# EAGLE design SenseBox-Shield_v10 (EAGLE 7.5.0)
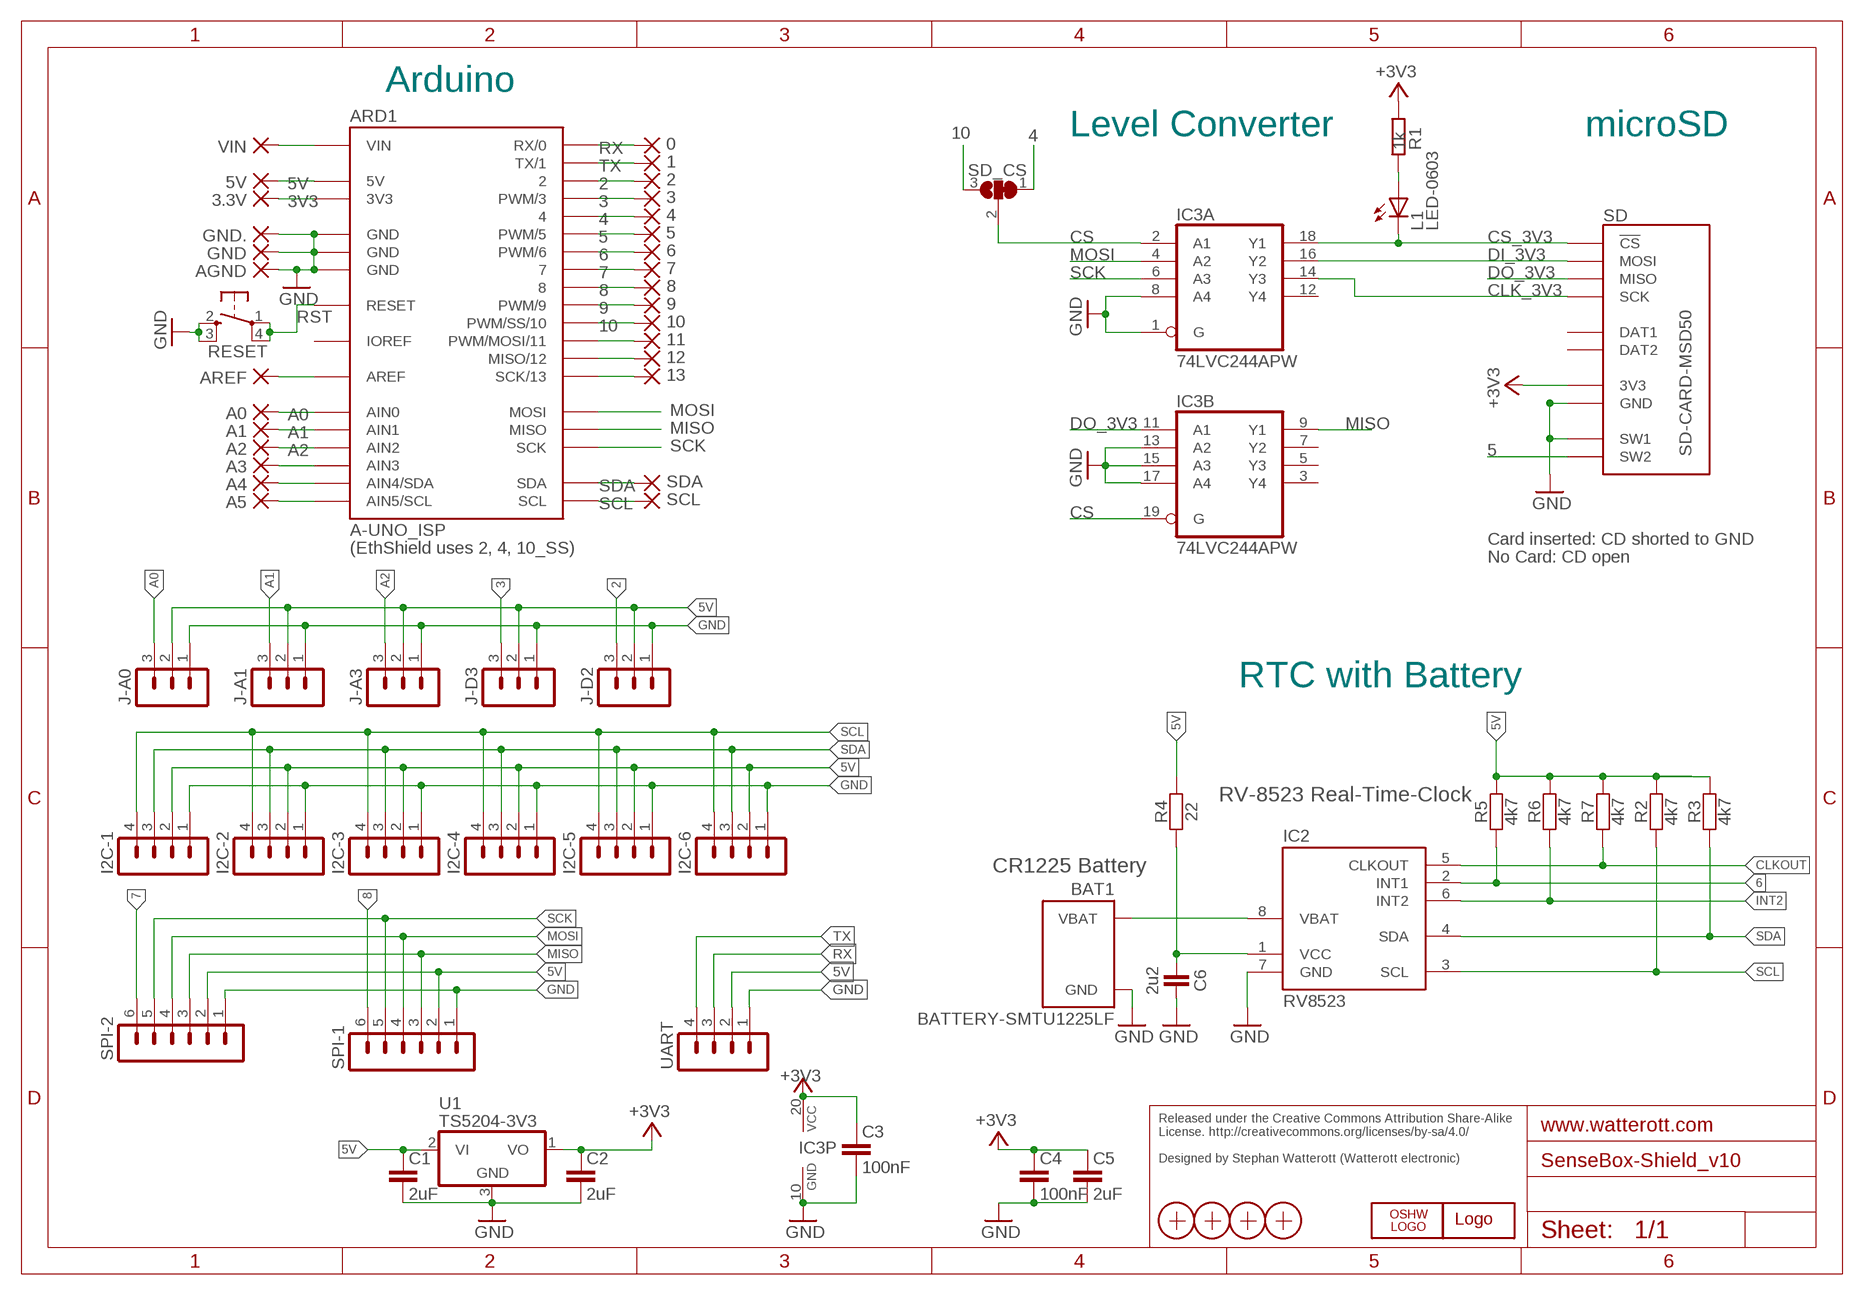
[diagram p0: schematic, sheet 1]

## Parts
0  1,6/0,8  [1,6/0,8]
1  1,6/0,8  [1,6/0,8]
2  1,6/0,8  [1,6/0,8]
3  1,6/0,8  [1,6/0,8]
3.3V  1,6/0,8  [1,6/0,8]
4  1,6/0,8  [1,6/0,8]
5  1,6/0,8  [1,6/0,8]
5V  1,6/0,8  [1,6/0,8]
6  1,6/0,8  [1,6/0,8]
7  1,6/0,8  [1,6/0,8]
8  1,6/0,8  [1,6/0,8]
9  1,6/0,8  [1,6/0,8]
10  1,6/0,8  [1,6/0,8]
11  1,6/0,8  [1,6/0,8]
12  1,6/0,8  [1,6/0,8]
13  1,6/0,8  [1,6/0,8]
A0  1,6/0,8  [1,6/0,8]
A1  1,6/0,8  [1,6/0,8]
A2  1,6/0,8  [1,6/0,8]
A3  1,6/0,8  [1,6/0,8]
A4  1,6/0,8  [1,6/0,8]
A5  1,6/0,8  [1,6/0,8]
AGND  1,6/0,8  [1,6/0,8]
ARD1  A-UNO_ISP  [A-UNO-ISP]
AREF  1,6/0,8  [1,6/0,8]
BAT1  BATTERY-SMTU1225LF  [BAT-SMTU1225LF]
C1  2uF  C-EUC0805  [C0805]
C2  2uF  C-EUC0805  [C0805]
C3  100nF  C-EUC0603  [C0603]
C4  100nF  C-EUC0603  [C0603]
C5  2uF  C-EUC0603  [C0603]
C6  2u2  CAPACITOR-C0603  [R0603]
GND  1,6/0,8  [1,6/0,8]
GND.  1,6/0,8  [1,6/0,8]
I2C-1  JST_PH_4B4B-PH-SM4-TB  [JST_B4B-PH-SM4-TB]
I2C-2  JST_PH_4B4B-PH-SM4-TB  [JST_B4B-PH-SM4-TB]
I2C-3  JST_PH_4B4B-PH-SM4-TB  [JST_B4B-PH-SM4-TB]
I2C-4  JST_PH_4B4B-PH-SM4-TB  [JST_B4B-PH-SM4-TB]
I2C-5  JST_PH_4B4B-PH-SM4-TB  [JST_B4B-PH-SM4-TB]
I2C-6  JST_PH_4B4B-PH-SM4-TB  [JST_B4B-PH-SM4-TB]
IC2  RV8523  RV8523-C3  [RTC-C3]
IC3  74LVC244APW  74LVC244PW  [TSSOP20]
J-A0  JST_PH_3B3B-PH-SM4-TB  [JST_B3B-PH-SM4-TB]
J-A1  JST_PH_3B3B-PH-SM4-TB  [JST_B3B-PH-SM4-TB]
J-A3  JST_PH_3B3B-PH-SM4-TB  [JST_B3B-PH-SM4-TB]
J-D2  JST_PH_3B3B-PH-SM4-TB  [JST_B3B-PH-SM4-TB]
J-D3  JST_PH_3B3B-PH-SM4-TB  [JST_B3B-PH-SM4-TB]
L1  LED-0603  [LED_0603]
LOGO2  WE-LOGOPLACE  [WE-LOGO]
LOGO3  OSHW_LOGO_6MILX0100-NT  [OSHW_6X100_NOTEXT]
R1  1k  R-EU_R0603  [R0603]
R2  4k7  RESISTOR-R0603  [R0603]
R3  4k7  RESISTOR-R0603  [R0603]
R4  22  RESISTOR-R0603  [R0603]
R5  4k7  RESISTOR-R0603  [R0603]
R6  4k7  RESISTOR-R0603  [R0603]
R7  4k7  RESISTOR-R0603  [R0603]
RESET  SW4S  [SW_SMD4]
SCL  1,6/0,8  [1,6/0,8]
SD  SD-CARD-MSD50  [SD_5031821853]
SD_CS  SJ2W  [SJ_2]
SDA  1,6/0,8  [1,6/0,8]
SPI-1  JST_PH_6B6B-PH-SM4-TB  [JST_B6B-PH-SM4-TB]
SPI-2  JST_PH_6B6B-PH-SM4-TB  [JST_B6B-PH-SM4-TB]
U1  TS5204-3V3  TS5204  [SOT23]
UART  JST_PH_4B4B-PH-SM4-TB  [JST_B4B-PH-SM4-TB]
VIN  1,6/0,8  [1,6/0,8]
X1  PASSER  [PASSER]
X2  PASSER  [PASSER]
X3  PASSER  [PASSER]
X4  PASSER  [PASSER]

## Nets
2: 2.1(P) ARD1.2 J-D2.3
3: 3.1(P) ARD1.3(PWM/3) J-D3.3
3V3: 3.3V.1(P) ARD1.3V3
4: 4.1(P) ARD1.4 SD_CS.1
5: 5.1(P) ARD1.5(PWM/5) SD.SW2
5V: 5V.1(P) ARD1.5V C1.1 I2C-1.2 I2C-2.2 I2C-3.2 I2C-4.2 I2C-5.2 I2C-6.2 J-A0.2 J-A1.2 J-A3.2 J-D2.2 J-D3.2 R2.2 R3.2 R4.2 R5.2 R6.2 R7.2 SPI-1.2 SPI-2.2 U1.2(VI) UART.2
6: 6.1(P) ARD1.6(PWM/6) IC2.2(INT1) R5.1
7: 7.1(P) ARD1.7 SPI-2.6
8: 8.1(P) ARD1.8 SPI-1.6
9: 9.1(P) ARD1.9(PWM/9)
10: 10.1(P) ARD1.10(PWM/SS/10) SD_CS.3
11: 11.1(P) ARD1.11(PWM/MOSI/11)
12: 12.1(P) ARD1.12(MISO/12)
13: 13.1(P) ARD1.13(SCK/13)
+3V3: C2.1 C3.1 C4.1 C5.1 IC3.20(P:VCC) R1.1 SD.VCC(3V3) U1.1(VO)
A0: A0.1(P) ARD1.A0(AIN0) J-A0.3
A1: A1.1(P) ARD1.A1(AIN1) J-A1.3
A2: A2.1(P) ARD1.A2(AIN2) J-A3.3
AIN3: A3.1(P) ARD1.A3(AIN3)
AIN4: A4.1(P) ARD1.A4(AIN4/SDA)
AIN5: A5.1(P) ARD1.A5(AIN5/SCL)
AREF: ARD1.AREF AREF.1(P)
CLK_3V3: IC3.14(A:Y3) SD.SCK
CLKOUT: IC2.5(CLKOUT) R7.1
CS: IC3.2(A:A1) IC3.19(B:G) SD_CS.2
CS_3V3: IC3.18(A:Y1) L1.C SD.CS(!CS)
DI_3V3: IC3.16(A:Y2) SD.MOSI
DO_3V3: IC3.11(B:A1) SD.MISO
GND: AGND.1(P) ARD1.GND@1(GND) ARD1.GND@2(GND) ARD1.GND@3(GND) BAT1.-(GND) C1.2 C2.2 C3.2 C4.2 C5.2 C6.2 GND.1(P) GND..1(P) I2C-1.1 I2C-2.1 I2C-3.1 I2C-4.1 I2C-5.1 I2C-6.1 IC2.7(GND) IC3.1(A:G) IC3.8(A:A4) IC3.10(P:GND) IC3.13(B:A2) IC3.15(B:A3) IC3.17(B:A4) J-A0.1 J-A1.1 J-A3.1 J-D2.1 J-D3.1 RESET.2(S) RESET.3(S1) SD.GND SD.SW1 SPI-1.1 SPI-2.1 U1.3(GND) UART.1
INT2: IC2.6(INT2) R6.1
MISO: ARD1.MISO IC3.9(B:Y1) SPI-1.3 SPI-2.3
MOSI: ARD1.MOSI IC3.4(A:A2) SPI-1.4 SPI-2.4
N$12: L1.A R1.2
RST: ARD1.RST(RESET) RESET.1(P) RESET.4(P1)
RV_VCC: C6.1 IC2.1(VCC) R4.1
RX: 0.1(P) ARD1.0(RX/0) UART.3
SCK: ARD1.SCK IC3.6(A:A3) SPI-1.5 SPI-2.5
SCL: ARD1.SCL I2C-1.4 I2C-2.4 I2C-3.4 I2C-4.4 I2C-5.4 I2C-6.4 IC2.3(SCL) R2.1 SCL.1(P)
SDA: ARD1.SDA I2C-1.3 I2C-2.3 I2C-3.3 I2C-4.3 I2C-5.3 I2C-6.3 IC2.4(SDA) R3.1 SDA.1(P)
TX: 1.1(P) ARD1.1(TX/1) UART.4
VBAT: BAT1.+(VBAT) IC2.8(VBAT)
VIN: ARD1.VIN VIN.1(P)
Unconnected: IC3.3(B:Y4) IC3.5(B:Y3) IC3.7(B:Y2) IC3.12(A:Y4) SD.DAT1 SD.DAT2

## Notes on the sheet
- Arduino
- Level Converter | microSD
- Card inserted: CD shorted to GND
- (EthShield uses 2, 4, 10_SS)
- No Card: CD open
- RTC with Battery
- RV-8523 Real-Time-Clock
- CR1225 Battery
- Released under the Creative Commons Attribution Share-Alike 
  License. http://creativecommons.org/licenses/by-sa/4.0/
  
  Designed by Stephan Watterott (Watterott electronic)

## Power pins joined to a net without a drawn wire
IOREF: ARD1.IOREF

## Library data of the parts
0 1-3 3.3V 4 5 5V 6-13 A0 A1-A5 AGND AREF GND GND. SCL SDA VIN = wirepad:1,6/0,8: THROUGH-HOLE PAD
ARD1 = we-board:A-UNO_ISP: Arduino Uno
BAT1 = we-power:BATTERY: Battery Holder
C1-C5 = rcl:C-EU: CAPACITOR, European symbol
C6 = we-rcl:CAPACITOR: Capacitors ...2.2uF -> 0603 ...4.7uF -> 0805 ...10uF -> 1206
I2C-1-I2C-6 UART = we-con:JST_PH_4
IC2 = we-chip:RV8523: Micro Crystal RV-8323 RTC (Real Time Clock)
IC3 = we-chip:74*244: 74x244 Octal Buffer and Line Driver (3-State)
J-A0 J-A1 J-A3 J-D2 J-D3 = we-con:JST_PH_3: JST Connector
L1 = we-opto:LED
LOGO2 = welectronic:WE-LOGO
LOGO3 = OSHW:OSHW_LOGO_6MIL
R1 = rcl:R-EU_: RESISTOR, European symbol
R2-R7 = we-rcl:RESISTOR: Resistors all kinds in 0603
RESET = Switch-SMD:SW4
SD = we-con:SD-CARD; DIGIKEY: WM9750TR-ND
SD_CS = jumper:SJ2W: SMD solder JUMPER
SPI-1 SPI-2 = we-con:JST_PH_6
U1 = Voltage-Reg:TS5204
X1-X4 = SMD:PASSER

## Board
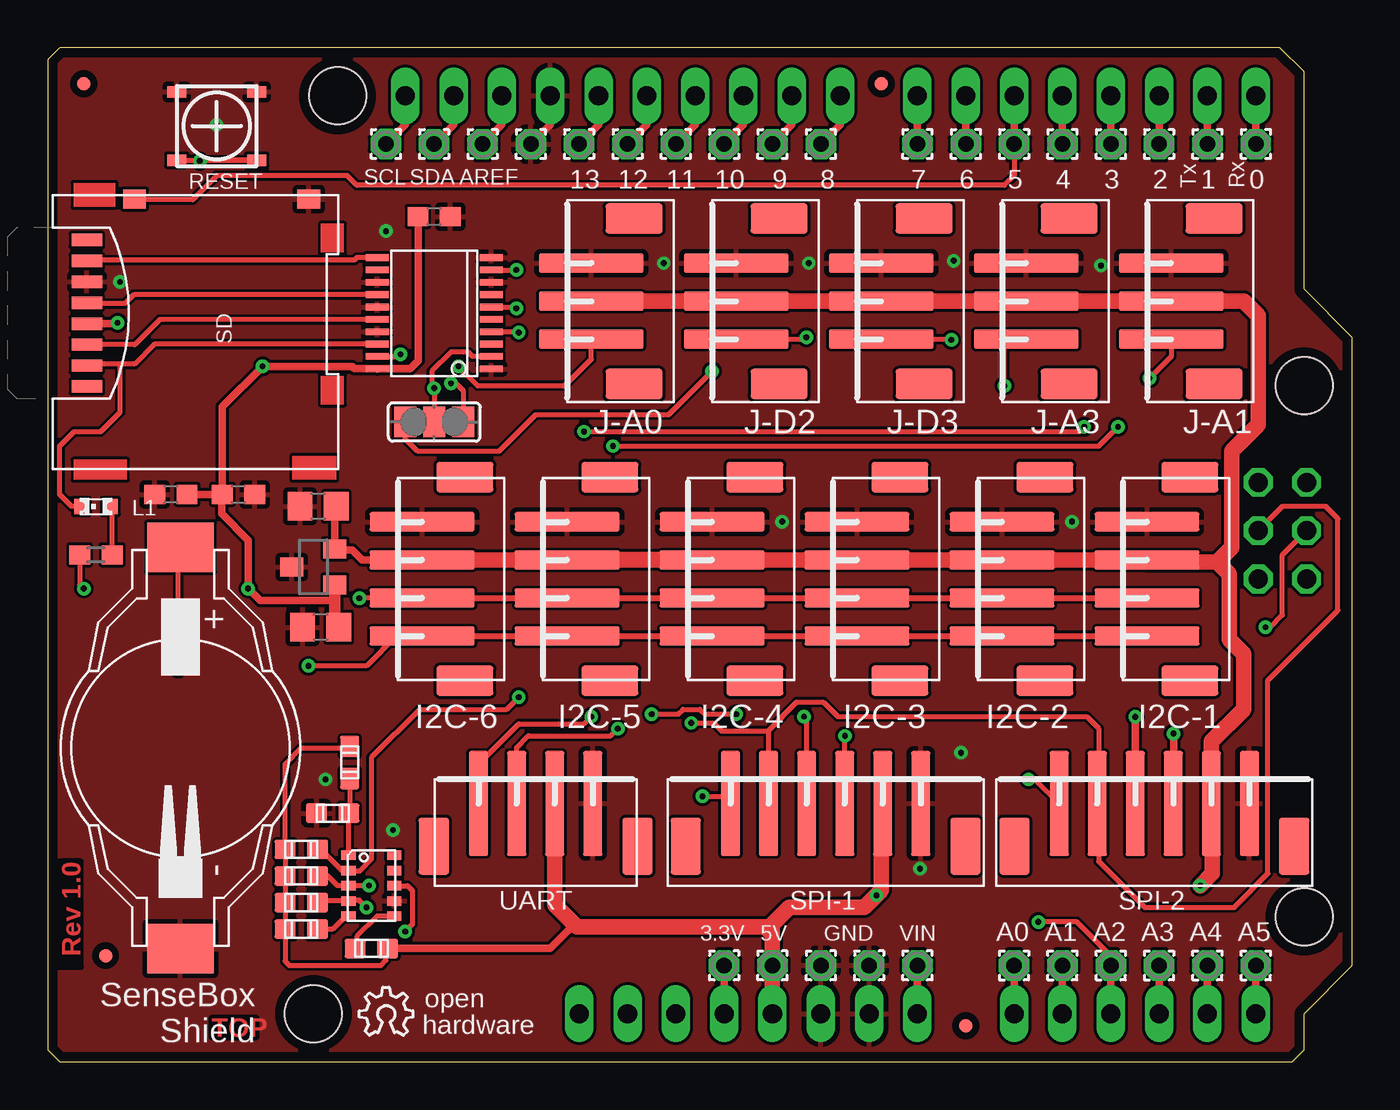
[diagram p1: board, top side]
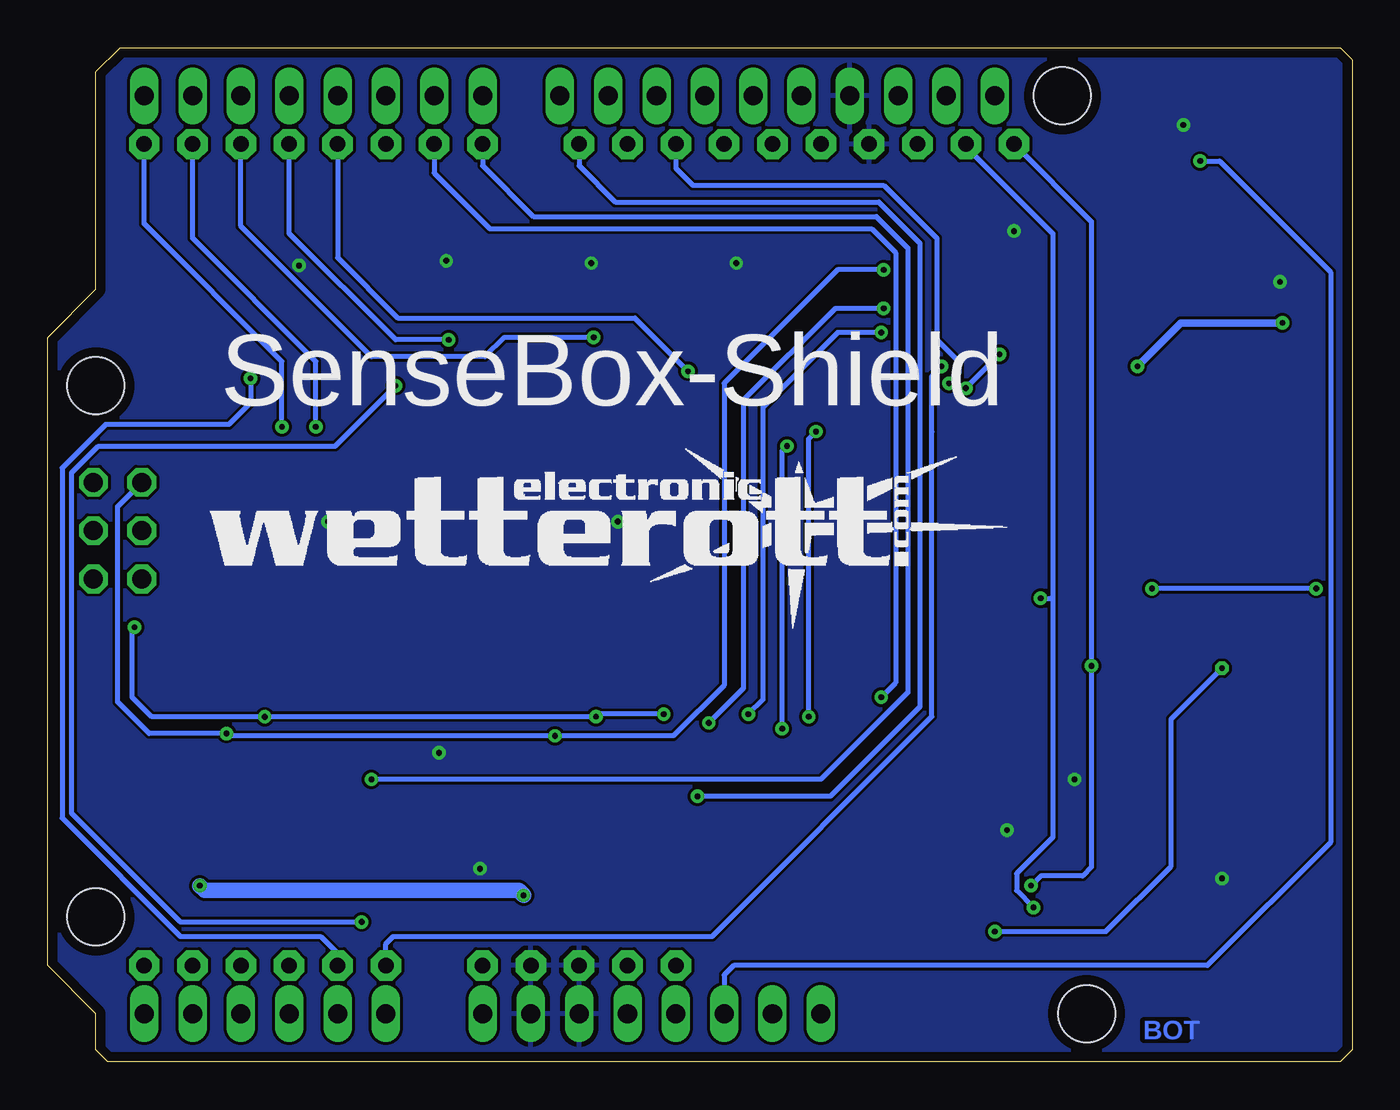
[diagram p2: board, bottom side, seen from below]

Size 68.58 x 53.34 mm. Coordinates in mm from the lower left corner, seen from the top.
Copper layers (1*16): Top 0.035mm / dielectric 1.5mm / Bottom 0.035mm
Design rules "default *": minimum track width 6mil, minimum drill 0.29mm, track to track 6mil, track to pad 6mil, pad to pad 6mil, via to via 6mil, smd to smd 0mil, copper to edge 20mil, drill to drill 8mil, minimum pad ring 10mil, minimum via ring 8mil, stop-mask expansion 4mil, vias tented up to drill 0.5mm, thermal gap 10mil

### Footprints (pad centres in the part's own frame; a part is rotated, then mirrored left to right if it is on the bottom)
1,6/0,8 = drill 0.813 pad 1.6 octagon: 1 0,0
A-UNO-ISP = drill 1 long: 0 63.5,50.8; 1 60.96,50.8; 2 58.42,50.8; 3 55.88,50.8; 3V3 35.56,2.54; 4 53.34,50.8; 5 50.8,50.8; 5V 38.1,2.54; 6 48.26,50.8; 7 45.72,50.8; 8 41.656,50.8; 9 39.116,50.8; 10 36.576,50.8; 11 34.036,50.8; 12 31.496,50.8; 13 28.956,50.8; A0 50.8,2.54; A1 53.34,2.54; A2 55.88,2.54; A3 58.42,2.54; A4 60.96,2.54; A5 63.5,2.54; AREF 23.876,50.8; GND@1 40.64,2.54; GND@2 43.18,2.54; GND@3 26.416,50.8; IOREF 30.48,2.54; NC 27.94,2.54; RST 33.02,2.54; SCL 18.796,50.8; SDA 21.336,50.8; VIN 45.72,2.54 | drill 1 octagon: GND@4 66.167,25.4; MISO 63.627,30.48; MOSI 66.167,27.94; RST2 63.627,25.4; SCK 63.627,27.94; VCC 66.167,30.48 | hole 3: 66.04,35.56; 66.04,7.62; 15.24,50.8; 13.97,2.54
BAT-SMTU1225LF = smd 3.5 x 2.6: + 0,10.55; - 0,-10.55
C0805 = smd 1.3 x 1.5: 1 -0.95,0; 2 0.95,0
C0603 = smd 1.1 x 1: 1 -0.85,0; 2 0.85,0
R0603 = smd 1 x 1.1: 1 0,0.85; 2 0,-0.85
JST_B4B-PH-SM4-TB = smd 5.5 x 1: 1 0,3; 2 0,1; 3 0,-1; 4 0,-3 | smd 3 x 1.6: SHLD1 2.25,5.35; SHLD2 2.25,-5.35
RTC-C3 = smd 0.8 x 0.5: 1 -1.2,1.6; 2 -1.2,0.8; 3 -1.2,0; 4 -1.2,-0.8; 5 -1.2,-1.6; 6 1.2,-1.6; 7 1.2,-0.8; 8 1.2,0; 9 1.2,0.8; 10 1.2,1.6
TSSOP20 = smd 0.35 x 1.2: 1 -2.925,-3; 2 -2.275,-3; 3 -1.625,-3; 4 -0.975,-3; 5 -0.325,-3; 6 0.325,-3; 7 0.975,-3; 8 1.625,-3; 9 2.275,-3; 10 2.925,-3; 11 2.925,3; 12 2.275,3; 13 1.625,3; 14 0.975,3; 15 0.325,3; 16 -0.325,3; 17 -0.975,3; 18 -1.625,3; 19 -2.275,3; 20 -2.925,3
JST_B3B-PH-SM4-TB = smd 5.5 x 1: 1 0,2; 2 0,0; 3 0,-2 | smd 3 x 1.6: SHLD1 2.25,4.35; SHLD2 2.25,-4.35
LED_0603 = smd 0.8 x 0.8: A 0,-0.75; C 0,0.75
R0603' = smd 1.1 x 1: 1 -0.85,0; 2 0.85,0
SW_SMD4 = smd 0.61 x 1.016: 1 -1.8,-2.1; 2 1.8,-2.1; 3 1.8,2.1; 4 -1.8,2.1
SD_5031821853 = smd 0.65 x 1.6: CS 2.75,0.8; DAT1 -3.85,0.8; DAT2 3.85,0.8; GND -1.65,0.8; MISO -2.75,0.8; MOSI 1.65,0.8; SCK -0.55,0.8; VCC 0.55,0.8 | smd 1 x 1.2: SW1 -6,12.45; SW2 -6,3.3
SJ_2 = smd 1.168 x 1.6: 1 -1.524,0; 2 0,0; 3 1.524,0
JST_B6B-PH-SM4-TB = smd 5.5 x 1: 1 0,5; 2 0,3; 3 0,1; 4 0,-1; 5 0,-3; 6 0,-5 | smd 3 x 1.6: SHLD1 2.25,7.35; SHLD2 2.25,-7.35
SOT23 = smd 1 x 1.2: 1 -0.95,-1.132; 2 0.95,-1.132; 3 0,1.132
PASSER = smd 0.7 x 0.7: X 0,0

### Placement (x,y rotation side)
0  63.5,48.26 0 top
1  60.96,48.26 0 top
2  58.42,48.26 0 top
3  55.88,48.26 0 top
3.3V  35.56,5.08 0 top
4  53.34,48.26 0 top
5  50.8,48.26 0 top
5V  38.1,5.08 0 top
6  48.26,48.26 0 top
7  45.72,48.26 0 top
8  40.64,48.26 0 top
9  38.1,48.26 0 top
10  35.56,48.26 0 top
11  33.02,48.26 0 top
12  30.48,48.26 0 top
13  27.94,48.26 0 top
A0  50.8,5.08 180 top
A1  53.34,5.08 180 top
A2  55.88,5.08 180 top
A3  58.42,5.08 180 top
A4  60.96,5.08 180 top
A5  63.5,5.08 180 top
AGND  25.4,48.26 0 top
ARD1  0,0 0 top
AREF  22.86,48.26 0 top
BAT1  6.99,16.51 0 top
C1  14.22,29.21 180 top
C2  14.35,22.86 180 top
C3  6.48,29.84 180 top
C4  20.32,44.45 0 top
C5  10.03,29.84 0 top
C6  14.99,13.08 270 top
GND  43.18,5.08 0 top
GND.  40.64,5.08 0 top
I2C-1  57.78,25.4 0 top
I2C-2  50.16,25.4 0 top
I2C-3  42.55,25.4 0 top
I2C-4  34.92,25.4 0 top
I2C-5  27.3,25.4 0 top
I2C-6  19.68,25.4 0 top
IC2  17.02,9.27 0 top
IC3  20.32,39.37 90 top
J-A0  28.57,40.01 0 top
J-A1  59.05,40.01 0 top
J-A3  51.44,40.01 0 top
J-D2  36.2,40.01 0 top
J-D3  43.81,40.01 0 top
L1  2.54,29.21 90 top
LOGO2  60.33,22.48 0 bottom
LOGO3  16.38,1.4 0 top
R1  1k  [R0603']  2.54,26.67 0 top
R2  13.34,9.78 270 top
R3  13.34,8.38 270 top
R4  15.88,15.75 180 top
R5  13.34,11.18 270 top
R6  17.02,5.97 90 top
R7  13.34,6.99 270 top
RESET  8.89,49.21 90 top
SCL  17.78,48.26 0 top
SD  1.27,39.37 270 top
SD_CS  20.32,33.66 0 top
SDA  20.32,48.26 0 top
SPI-1  40.89,13.59 270 top
SPI-2  58.17,13.59 270 top
U1  13.97,26.04 90 top
UART  25.65,13.59 270 top
VIN  45.72,5.08 0 top
X1  3.05,5.59 0 top
X2  1.91,51.44 0 top
X3  43.81,51.44 0 top
X4  48.26,1.91 0 top

### Tracks (layer width: path | path; a pad name or v marks a point on that pad's centre or on a via)
2  (via drill 0.3)
  Top 0.254: J-D2.3 39.78,38.01 v39.88,38.1
  Top 0.406: ARD1.2 2.1
  Bottom 0.254: v39.88,38.1 44.58,38.1 45.59,37.08 51.56,37.08 58.42,43.94 2.1
3  (via drill 0.3)
  Top 0.254: J-D3.3 47.47,38.01 v47.5,37.97
  Top 0.406: ARD1.3 3.1
  Bottom 0.254: v47.5,37.97 50.29,37.97 55.88,43.56 3.1
3V3
  Top 0.406: ARD1.3V3 3.3V.1
4  (via drill 0.3)
  Top 0.254: SD_CS.1 18.8,32.77 19.43,32.13 23.75,32.13 25.65,34.04 32.64,34.04 v34.92,36.32
  Top 0.406: ARD1.4 4.1
  Bottom 0.254: 4.1 53.34,42.29 50.16,39.12 37.72,39.12 v34.92,36.32
5
  Top 0.254: 5.1 50.8,46.61 50.29,46.1 16.26,46.1 15.75,46.61 8.89,46.61 7.62,45.34 4.6,45.34 SD.SW2
  Top 0.406: ARD1.5 5.1
5V  (via drill 0.3)
  Top 0.254: R4.2 15.79,16.51 13.34,16.51 12.48,15.66 R5.2 R2.2 R3.2 R7.2 12.48,5.29 12.7,5.08 17.53,5.08 17.78,5.33 17.78,5.88 R6.2
  Top 0.406: C1.1 15.1,29.03 U1.2 15.16,26.92 16,26.92 16.53,26.4 I2C-6.2 | R6.2 26.42,5.97 27.69,7.24
  Top 0.813: I2C-2.2 I2C-1.2 57.9,26.29 61.47,26.29 | I2C-4.2 I2C-3.2 I2C-2.2 | 26.67,26.42 26.69,26.4 I2C-5.2 I2C-4.2 | 26.67,26.42 34.91,26.42 I2C-4.2 | I2C-2.2 57.67,26.4 | 57.67,26.4 57.78,26.29 | 57.67,26.4 57.66,26.42 57.91,26.42 | 61.47,26.29 62.1,25.65 62.1,22.23 62.87,21.46 62.87,18.54 61.17,16.84 SPI-2.2 61.21,13.54 61.21,9.91 v60.58,9.27 | I2C-6.2 26.65,26.4 26.67,26.42 | ARD1.5V 5V.1 | 5V.1 | 5V.1 38.1,6.73 | 38.1,6.73 38.1,7.24 38.99,8.13 42.93,8.13 v43.56,8.76 43.81,9.02 43.81,13.67 | 43.81,14.22 43.81,13.67 | 43.81,13.67 SPI-1.2 | UART.2 26.65,8.27 27.69,7.24 27.81,7.11 37.72,7.11 38.1,6.73 | J-A0.2 J-D2.2 J-D3.2 J-A3.2 J-A1.2 62.87,40.01 63.63,39.24 63.63,33.53 62.23,32.13 62.23,27.05 61.47,26.29
  Bottom 0.813: v60.58,9.27 60.33,9.02 43.81,9.02 v43.56,8.76
6  (via drill 0.3)
  Top 0.254: R5.1 14.35,11.18 15.46,10.07 IC2.2 15.86,10.03 16.38,10.03 17.02,10.67 17.02,16 19.56,18.54 24.13,18.54 v24.77,19.18
  Top 0.406: ARD1.6 6.1
  Bottom 0.254: 6.1 48.26,46.74 45.34,43.81 25.27,43.81 24,42.55 24,19.94 v24.77,19.18
7  (via drill 0.3)
  Top 0.254: v51.56,14.86 51.9,14.86 SPI-2.6
  Top 0.406: ARD1.7 7.1
  Bottom 0.254: 7.1 45.72,47.12 43.05,44.45 25.02,44.45 23.37,42.8 23.37,19.43 27.94,14.86 v51.56,14.86
8  (via drill 0.3)
  Top 0.254: SPI-1.6 35.51,13.97 v34.42,13.97
  Top 0.406: ARD1.8 41.66,49.28 8.1
  Bottom 0.254: 8.1 40.64,47.12 38.73,45.21 24.89,45.21 22.73,43.05 22.73,18.67 27.43,13.97 v34.42,13.97
9
  Top 0.406: ARD1.9 39.12,49.28 9.1
10  (via drill 0.3)
  Top 0.254: SD_CS.3 21.84,35.31 21.46,35.69 v21.21,35.69
  Top 0.406: ARD1.10 36.58,49.28 10.1
  Bottom 0.254: 10.1 35.56,46.99 34.67,46.1 24.64,46.1 21.84,43.31 21.84,37.97 20.7,36.83 20.7,36.2 v21.21,35.69
11
  Top 0.406: ARD1.11 34.04,49.28 11.1
12
  Top 0.406: ARD1.12 31.5,49.28 12.1
13
  Top 0.406: ARD1.13 28.96,49.28 13.1
+3V3  (via drill 0.3)
  Top 0.254: R1.1 1.69,25.11 v1.91,24.89 | U1.1 15.1,24.27 15.11,24.26
  Top 0.406: C3.1 C5.1 | C4.1 19.47,36.87 19.05,36.45 IC3.20 16.13,36.45 16,36.58 v11.3,36.58 9.18,34.46 C5.1 | 15.11,24.26 11.18,24.26 v10.54,24.89 10.54,27.43 9.14,28.83 9.14,29.81 C5.1 | SD.VCC 3.64,38.82 v3.68,38.86
  Top 0.61: U1.1 15.1,23.04 C2.1
  Bottom 0.254: v1.91,24.89 v10.54,24.89
  Bottom 0.406: v3.68,38.86 9.02,38.86 v11.3,36.58
A0  (via drill 0.3)
  Top 0.254: v21.59,36.58 22.61,35.56 27.18,35.56 28.57,36.96 J-A0.3
  Top 0.406: ARD1.A0 A0.1
  Bottom 0.254: A0.1 50.8,6.22 50.42,6.6 33.66,6.6 22.1,18.16 22.1,33.15 22.1,35.56 22.1,36.07 v21.59,36.58
A1  (via drill 0.3)
  Top 0.254: J-A1.3 59.05,37.08 v57.91,35.94
  Top 0.406: ARD1.A1 A1.1
  Bottom 0.254: v57.91,35.94 57.91,34.67 59.05,33.53 65.53,33.53 67.82,31.24 67.82,12.83 61.59,6.6 54.23,6.6 53.34,5.71 A1.1
A2  (via drill 0.3)
  Top 0.254: A2.1 55.88,5.59 54.1,7.37 v52.07,7.37 | v50.29,35.56 50.29,37.97 50.42,38.1 51.34,38.1 J-A3.3
  Top 0.406: ARD1.A2 A2.1
  Bottom 0.254: v50.29,35.56 53.47,32.38 65.91,32.38 67.31,30.99 67.31,13.08 61.59,7.37 v52.07,7.37
AIN3
  Top 0.406: ARD1.A3 A3.1
AIN4
  Top 0.406: ARD1.A4 A4.1
AIN5
  Top 0.406: ARD1.A5 A5.1
AREF
  Top 0.406: ARD1.AREF 23.88,49.28 AREF.1
CLK_3V3
  Top 0.254: IC3.14 4.53,40.34 4.06,39.88 2.11,39.88 SD.SCK
CLKOUT
  Top 0.254: IC2.5 15.67,7.67 14.99,6.99 R7.1
CS  (via drill 0.3)
  Top 0.254: SD_CS.2 v20.32,35.43 20.19,35.56 20.19,36.32 21.21,37.34 22.1,37.34 22.34,37.09 IC3.2 | IC3.19 18.43,37.09 v18.54,37.21
  Bottom 0.254: v18.54,37.21 v20.32,35.43
CS_3V3
  Top 0.254: IC3.18 5.61,37.74 4.57,36.7 3.81,36.7 | 3.81,36.7 2.15,36.7 SD.CS | L1.C 1.27,29.21 0.64,29.84 0.64,32.38 1.4,33.15 2.79,33.15 3.81,34.16 3.81,36.7
DI_3V3
  Top 0.254: IC3.16 5.9,39.05 4.57,37.72 SD.MOSI
DO_3V3
  Top 0.254: IC3.11 16.26,42.3 16.13,42.16 2.11,42.16 SD.MISO
GND  (via drill 0.3)
  Top 0.406: ARD1.GND@3 26.42,49.28 AGND.1
  other vias: 6.86,9.65 48.01,16.26 45.85,10.16 38.61,28.42 53.85,28.42 55.37,41.88 47.62,42.13 40.01,42.01 32.38,42.01 3.81,41.02 17.78,43.69 8.89,49.28 14.61,14.86 18.16,12.19
  pour Top: 0,0 68.58,0 68.58,53.34 0,53.34
  pour Bottom: 0,0 68.58,0 68.58,53.34 0,53.34
INT2
  Top 0.254: IC2.6 17.32,7.67 16.26,6.6 16.26,6.06 R6.1
MISO  (via drill 0.3)
  Top 0.254: IC3.9 24.63,41.65 v24.64,41.66 | SPI-1.3 41.89,17.13 v41.91,17.14
  Top 0.406: 59.17,17.26 v59.18,17.27 59.18,13.59 SPI-2.3
  Bottom 0.254: ARD1.MISO 64.9,29.21 64.9,18.92 63.25,17.27 v59.18,17.27 59.05,17.14 42.42,17.14 v41.91,17.14 35.69,17.14 33.02,19.81 33.02,35.69 27.05,41.66 v24.64,41.66
MOSI  (via drill 0.3)
  Top 0.254: v64.01,22.86 64.26,22.86 64.9,23.5 64.9,26.67 ARD1.MOSI | IC3.4 24.72,38.4 v24.77,38.35 | SPI-1.4 39.89,18.02 v39.75,18.16 | v31.75,18.29 33.15,18.29 33.4,18.54 34.29,18.54 34.54,18.29 v36.2,18.29
  Top 0.406: SPI-2.4 v57.17,18.14
  Bottom 0.254: 64.14,22.73 64.14,19.18 63.1,18.14 v57.17,18.14 57.26,18.14 57.28,18.16 v39.75,18.16 39.62,18.29 v36.2,18.29 | v24.77,38.35 27.05,38.35 30.99,34.42 30.99,19.05 v31.75,18.29
  Bottom 0.305: 64.14,22.73 v64.01,22.86
N$12
  Top 0.254: R1.2 3.39,29.11 L1.A
RST  (via drill 0.3)
  Top 0.254: RESET.4 RESET.1 8.04,47.41 v8,47.37
  Bottom 0.254: v8,47.37 6.99,47.37 1.14,41.53 1.14,11.56 7.62,5.08 32.51,5.08 33.02,4.57 ARD1.RST
RV_VCC
  Top 0.254: IC2.1 15.82,13.06 C6.1 15.88,13.12 R4.1
RX  (via drill 0.3)
  Top 0.254: UART.3 24.65,16.53 25.27,17.14 29.59,17.14 v29.97,17.53 | v29.72,32.38 55.24,32.38 v56.26,33.4
  Top 0.406: ARD1.0 0.1
  Bottom 0.254: v29.97,17.53 29.97,32.13 v29.72,32.38 | v56.26,33.4 56.26,36.83 63.5,44.07 0.1
SCK  (via drill 0.3)
  Top 0.254: ARD1.SCK 64.9,29.21 67.18,29.21 67.82,28.57 67.82,23.75 64.14,20.07 64.14,9.91 62.36,8.13 57.66,8.13 55.24,10.54 55.24,13.67 | IC3.6 24.57,39.7 v24.64,39.62 | SPI-1.5 37.89,17.45 | 37.89,17.45 39.37,18.92 40.77,18.92 41.53,18.16 54.61,18.16 55.24,17.53 55.24,13.67 | 55.24,13.67 SPI-2.5 | v33.83,17.83 35,17.83 35.43,17.4 37.85,17.4 37.89,17.45
  Bottom 0.254: v24.64,39.62 27.18,39.62 32,34.8 32,19.65 v33.83,17.83
SCL  (via drill 0.3)
  Top 0.254: I2C-6.4 18.34,22.4 16.76,20.83 v13.72,20.83 | R2.1 14.73,9.78 15.24,9.27 IC2.3 v16.89,9.27
  Top 0.305: I2C-6.4 I2C-5.4 I2C-4.4 I2C-3.4 I2C-2.4 I2C-1.4
  Top 0.406: ARD1.SCL 18.8,49.28 SCL.1
  Bottom 0.254: SCL.1 13.72,44.2 v13.72,20.83 13.72,10.25 R2.1 16.38,9.78 v16.89,9.27
SDA  (via drill 0.3)
  Top 0.254: I2C-6.3 16.4,24.4 v16.38,24.38 | R3.1 14.27,8.47 IC2.4 15.86,8.51 16.38,8.51 v16.76,8.13
  Top 0.305: I2C-6.3 I2C-5.3 I2C-4.3 I2C-3.3 I2C-2.3 I2C-1.3
  Top 0.406: ARD1.SDA 21.34,49.28 SDA.1
  Bottom 0.254: SDA.1 20.32,48.13 15.75,43.56 15.75,24.26 | 15.75,24.26 15.75,11.81 17.65,9.91 17.65,9.02 v16.76,8.13 | v16.38,24.38 15.88,24.38 15.75,24.26
TX  (via drill 0.3)
  Top 0.254: UART.4 22.65,15.67 24.77,17.78 28.19,17.78 v28.57,18.16 | v28.19,33.15 54.23,33.15 v54.48,33.4
  Top 0.406: ARD1.1 1.1
  Bottom 0.254: v28.57,18.16 28.57,32.77 v28.19,33.15 | v54.48,33.4 54.48,36.83 60.96,43.31 1.1
VBAT  (via drill 0.3)
  Top 0.254: IC2.8 18.92,9.27 19.18,9.02 19.18,7.24 v18.8,6.86 | v6.86,20.7 6.86,26.93 BAT1.+
  Bottom 0.254: v18.8,6.86 12.95,6.86 9.53,10.29 9.53,18.03 v6.86,20.7
VIN
  Top 0.406: ARD1.VIN VIN.1

### Text on the board
Top: Rev 1.0 | TOP
Bottom: BOT
tPlace: Tx | Rx | SenseBox / Shield | open | hardware
bPlace: SenseBox-Shield
Reference: Silkscreen: 21 tPlace + 25 tNames + 22 bPlace